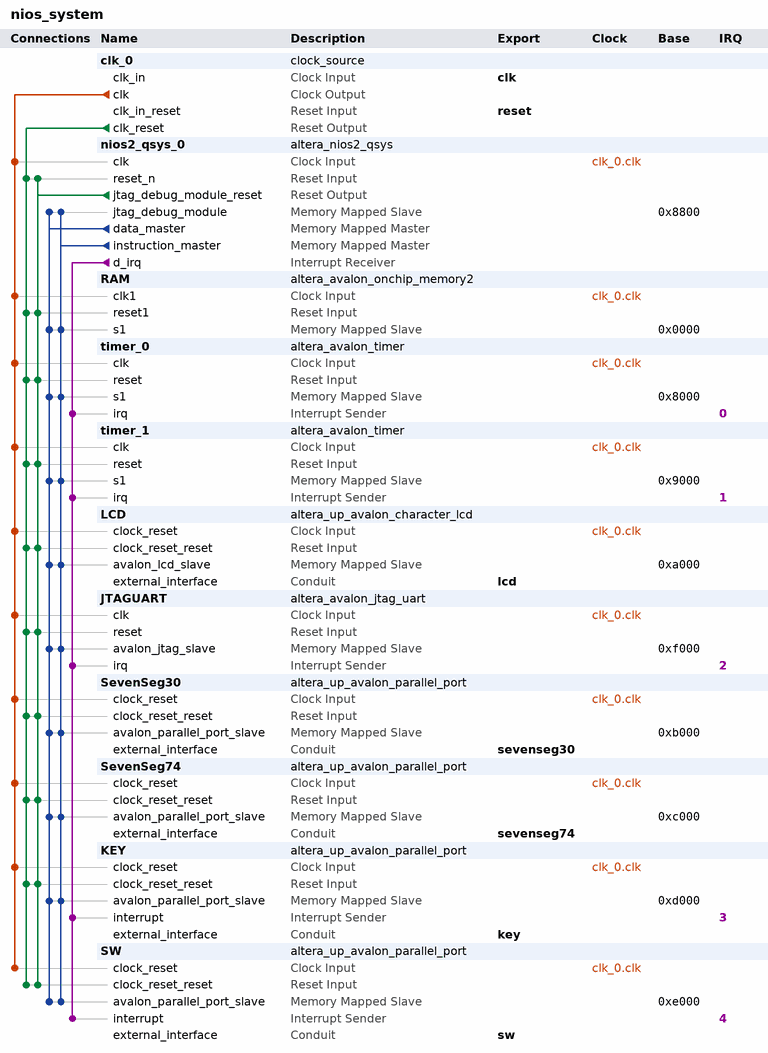
[diagram p0: system contents]
# Platform Designer (Qsys) system nios_system, Cyclone II EP2C35F672C6
# Parameters at their usual value, and those the tool derives, are not listed.
package require -exact qsys 13.0
create_system nios_system
set_project_property DEVICE_FAMILY {Cyclone II}
set_project_property DEVICE EP2C35F672C6

add_instance clk_0 clock_source 13.0
set_instance_parameter_value clk_0 clockFrequency 50000000

add_instance nios2_qsys_0 altera_nios2_qsys 13.0
set_instance_parameter_value nios2_qsys_0 resetSlave RAM.s1
set_instance_parameter_value nios2_qsys_0 mmu_TLBMissExcSlave None
set_instance_parameter_value nios2_qsys_0 exceptionSlave RAM.s1
set_instance_parameter_value nios2_qsys_0 breakSlave nios2_qsys_0.jtag_debug_module
set_instance_parameter_value nios2_qsys_0 impl Small
set_instance_parameter_value nios2_qsys_0 icache_size 4096

add_instance RAM altera_avalon_onchip_memory2 13.0.1.99.2
set_instance_parameter_value RAM dataWidth 32
set_instance_parameter_value RAM dualPort false
set_instance_parameter_value RAM initMemContent true
set_instance_parameter_value RAM initializationFileName onchip_mem.hex
set_instance_parameter_value RAM memorySize 24576

add_instance timer_0 altera_avalon_timer 13.0.1.99.2
set_instance_parameter_value timer_0 period 10
set_instance_parameter_value timer_0 periodUnits MSEC

add_instance timer_1 altera_avalon_timer 13.0.1.99.2
set_instance_parameter_value timer_1 period 1
set_instance_parameter_value timer_1 periodUnits MSEC

add_instance LCD altera_up_avalon_character_lcd 13.0
set_instance_parameter_value LCD cursor Normal

add_instance JTAGUART altera_avalon_jtag_uart 13.0.1.99.2
set_instance_parameter_value JTAGUART simInteractiveOptions NO_INTERACTIVE_WINDOWS

add_instance SevenSeg30 altera_up_avalon_parallel_port 13.0
set_instance_parameter_value SevenSeg30 board DE2
set_instance_parameter_value SevenSeg30 preset {Seven Segment Displays}
set_instance_parameter_value SevenSeg30 capture false
set_instance_parameter_value SevenSeg30 edge Rising
set_instance_parameter_value SevenSeg30 irq false

add_instance SevenSeg74 altera_up_avalon_parallel_port 13.0
set_instance_parameter_value SevenSeg74 board DE2
set_instance_parameter_value SevenSeg74 preset {Seven Segment Displays}
set_instance_parameter_value SevenSeg74 sevensegs {7 to 4}
set_instance_parameter_value SevenSeg74 capture false
set_instance_parameter_value SevenSeg74 edge Rising
set_instance_parameter_value SevenSeg74 irq false

add_instance KEY altera_up_avalon_parallel_port 13.0
set_instance_parameter_value KEY board DE2
set_instance_parameter_value KEY preset Pushbuttons
set_instance_parameter_value KEY capture true
set_instance_parameter_value KEY edge Rising
set_instance_parameter_value KEY irq true

add_instance SW altera_up_avalon_parallel_port 13.0
set_instance_parameter_value SW board DE2
set_instance_parameter_value SW preset {Slider Switches}
set_instance_parameter_value SW capture true
set_instance_parameter_value SW edge Rising
set_instance_parameter_value SW irq true

# connections
add_connection clk_0.clk JTAGUART.clk clock
add_connection clk_0.clk KEY.clock_reset clock
add_connection clk_0.clk LCD.clock_reset clock
add_connection clk_0.clk nios2_qsys_0.clk clock
add_connection clk_0.clk RAM.clk1 clock
add_connection clk_0.clk SevenSeg30.clock_reset clock
add_connection clk_0.clk SevenSeg74.clock_reset clock
add_connection clk_0.clk SW.clock_reset clock
add_connection clk_0.clk timer_0.clk clock
add_connection clk_0.clk timer_1.clk clock
add_connection clk_0.clk_reset JTAGUART.reset reset
add_connection clk_0.clk_reset KEY.clock_reset_reset reset
add_connection clk_0.clk_reset LCD.clock_reset_reset reset
add_connection clk_0.clk_reset nios2_qsys_0.reset_n reset
add_connection clk_0.clk_reset RAM.reset1 reset
add_connection clk_0.clk_reset SevenSeg30.clock_reset_reset reset
add_connection clk_0.clk_reset SevenSeg74.clock_reset_reset reset
add_connection clk_0.clk_reset SW.clock_reset_reset reset
add_connection clk_0.clk_reset timer_0.reset reset
add_connection clk_0.clk_reset timer_1.reset reset
add_connection nios2_qsys_0.jtag_debug_module_reset JTAGUART.reset reset
add_connection nios2_qsys_0.jtag_debug_module_reset KEY.clock_reset_reset reset
add_connection nios2_qsys_0.jtag_debug_module_reset LCD.clock_reset_reset reset
add_connection nios2_qsys_0.jtag_debug_module_reset nios2_qsys_0.reset_n reset
add_connection nios2_qsys_0.jtag_debug_module_reset RAM.reset1 reset
add_connection nios2_qsys_0.jtag_debug_module_reset SevenSeg30.clock_reset_reset reset
add_connection nios2_qsys_0.jtag_debug_module_reset SevenSeg74.clock_reset_reset reset
add_connection nios2_qsys_0.jtag_debug_module_reset SW.clock_reset_reset reset
add_connection nios2_qsys_0.jtag_debug_module_reset timer_0.reset reset
add_connection nios2_qsys_0.jtag_debug_module_reset timer_1.reset reset
add_connection nios2_qsys_0.data_master JTAGUART.avalon_jtag_slave avalon
set_connection_parameter_value nios2_qsys_0.data_master/JTAGUART.avalon_jtag_slave baseAddress 0xf000
add_connection nios2_qsys_0.data_master KEY.avalon_parallel_port_slave avalon
set_connection_parameter_value nios2_qsys_0.data_master/KEY.avalon_parallel_port_slave baseAddress 0xd000
add_connection nios2_qsys_0.data_master LCD.avalon_lcd_slave avalon
set_connection_parameter_value nios2_qsys_0.data_master/LCD.avalon_lcd_slave baseAddress 0xa000
add_connection nios2_qsys_0.data_master nios2_qsys_0.jtag_debug_module avalon
set_connection_parameter_value nios2_qsys_0.data_master/nios2_qsys_0.jtag_debug_module baseAddress 0x8800
add_connection nios2_qsys_0.data_master RAM.s1 avalon
set_connection_parameter_value nios2_qsys_0.data_master/RAM.s1 baseAddress 0x0000
add_connection nios2_qsys_0.data_master SevenSeg30.avalon_parallel_port_slave avalon
set_connection_parameter_value nios2_qsys_0.data_master/SevenSeg30.avalon_parallel_port_slave baseAddress 0xb000
add_connection nios2_qsys_0.data_master SevenSeg74.avalon_parallel_port_slave avalon
set_connection_parameter_value nios2_qsys_0.data_master/SevenSeg74.avalon_parallel_port_slave baseAddress 0xc000
add_connection nios2_qsys_0.data_master SW.avalon_parallel_port_slave avalon
set_connection_parameter_value nios2_qsys_0.data_master/SW.avalon_parallel_port_slave baseAddress 0xe000
add_connection nios2_qsys_0.data_master timer_0.s1 avalon
set_connection_parameter_value nios2_qsys_0.data_master/timer_0.s1 baseAddress 0x8000
add_connection nios2_qsys_0.data_master timer_1.s1 avalon
set_connection_parameter_value nios2_qsys_0.data_master/timer_1.s1 baseAddress 0x9000
add_connection nios2_qsys_0.instruction_master JTAGUART.avalon_jtag_slave avalon
set_connection_parameter_value nios2_qsys_0.instruction_master/JTAGUART.avalon_jtag_slave baseAddress 0xf000
add_connection nios2_qsys_0.instruction_master KEY.avalon_parallel_port_slave avalon
set_connection_parameter_value nios2_qsys_0.instruction_master/KEY.avalon_parallel_port_slave baseAddress 0xd000
add_connection nios2_qsys_0.instruction_master LCD.avalon_lcd_slave avalon
set_connection_parameter_value nios2_qsys_0.instruction_master/LCD.avalon_lcd_slave baseAddress 0xa000
add_connection nios2_qsys_0.instruction_master nios2_qsys_0.jtag_debug_module avalon
set_connection_parameter_value nios2_qsys_0.instruction_master/nios2_qsys_0.jtag_debug_module baseAddress 0x8800
add_connection nios2_qsys_0.instruction_master RAM.s1 avalon
set_connection_parameter_value nios2_qsys_0.instruction_master/RAM.s1 baseAddress 0x0000
add_connection nios2_qsys_0.instruction_master SevenSeg30.avalon_parallel_port_slave avalon
set_connection_parameter_value nios2_qsys_0.instruction_master/SevenSeg30.avalon_parallel_port_slave baseAddress 0xb000
add_connection nios2_qsys_0.instruction_master SevenSeg74.avalon_parallel_port_slave avalon
set_connection_parameter_value nios2_qsys_0.instruction_master/SevenSeg74.avalon_parallel_port_slave baseAddress 0xc000
add_connection nios2_qsys_0.instruction_master SW.avalon_parallel_port_slave avalon
set_connection_parameter_value nios2_qsys_0.instruction_master/SW.avalon_parallel_port_slave baseAddress 0xe000
add_connection nios2_qsys_0.instruction_master timer_0.s1 avalon
set_connection_parameter_value nios2_qsys_0.instruction_master/timer_0.s1 baseAddress 0x8000
add_connection nios2_qsys_0.instruction_master timer_1.s1 avalon
set_connection_parameter_value nios2_qsys_0.instruction_master/timer_1.s1 baseAddress 0x9000
add_connection nios2_qsys_0.d_irq JTAGUART.irq interrupt
set_connection_parameter_value nios2_qsys_0.d_irq/JTAGUART.irq irqNumber 2
add_connection nios2_qsys_0.d_irq KEY.interrupt interrupt
set_connection_parameter_value nios2_qsys_0.d_irq/KEY.interrupt irqNumber 3
add_connection nios2_qsys_0.d_irq SW.interrupt interrupt
set_connection_parameter_value nios2_qsys_0.d_irq/SW.interrupt irqNumber 4
add_connection nios2_qsys_0.d_irq timer_0.irq interrupt
set_connection_parameter_value nios2_qsys_0.d_irq/timer_0.irq irqNumber 0
add_connection nios2_qsys_0.d_irq timer_1.irq interrupt
set_connection_parameter_value nios2_qsys_0.d_irq/timer_1.irq irqNumber 1

# exported interfaces
add_interface clk clock sink
set_interface_property clk EXPORT_OF clk_0.clk_in
add_interface reset reset sink
set_interface_property reset EXPORT_OF clk_0.clk_in_reset
add_interface key conduit end
set_interface_property key EXPORT_OF KEY.external_interface
add_interface sevenseg30 conduit end
set_interface_property sevenseg30 EXPORT_OF SevenSeg30.external_interface
add_interface sevenseg74 conduit end
set_interface_property sevenseg74 EXPORT_OF SevenSeg74.external_interface
add_interface lcd conduit end
set_interface_property lcd EXPORT_OF LCD.external_interface
add_interface sw conduit end
set_interface_property sw EXPORT_OF SW.external_interface

set_interconnect_requirement {$system} qsys_mm.clockCrossingAdapter HANDSHAKE
set_interconnect_requirement {$system} qsys_mm.maxAdditionalLatency 1

save_system nios_system.qsys
